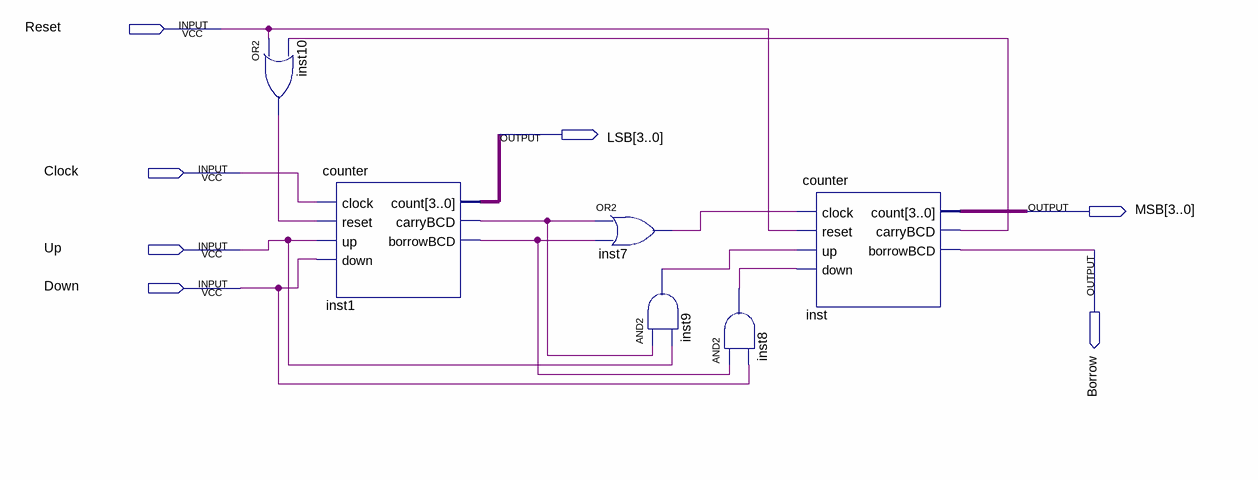
[diagram p0: schematic sheet]
// Quartus schematic CounterBlock.bdf as structural Verilog: 6 symbols, 7 pins
module CounterBlock (
  input  Reset,
  input  Clock,
  input  Up,
  input  Down,
  output [3:0] LSB,
  output [3:0] MSB,
  output Borrow
);

  wire inst1_borrowbcd, inst1_carrybcd, inst7_out, inst8_out, inst9_out, inst10_out, inst_carrybcd;

  or inst10 (inst10_out, Reset, inst_carrybcd);
  counter inst1 (
    .clock(Clock), .reset(inst10_out), .up(Up), .down(Down), .count(LSB), .carryBCD(inst1_carrybcd),
    .borrowBCD(inst1_borrowbcd));
  or inst7 (inst7_out, inst1_carrybcd, inst1_borrowbcd);
  and inst9 (inst9_out, inst1_carrybcd, Up);
  and inst8 (inst8_out, inst1_borrowbcd, Down);
  counter inst (
    .clock(inst7_out), .reset(Reset), .up(inst9_out), .down(inst8_out), .count(MSB),
    .carryBCD(inst_carrybcd), .borrowBCD(Borrow));
endmodule
